# Altium schematic sheet DACs.SchDoc
size A4
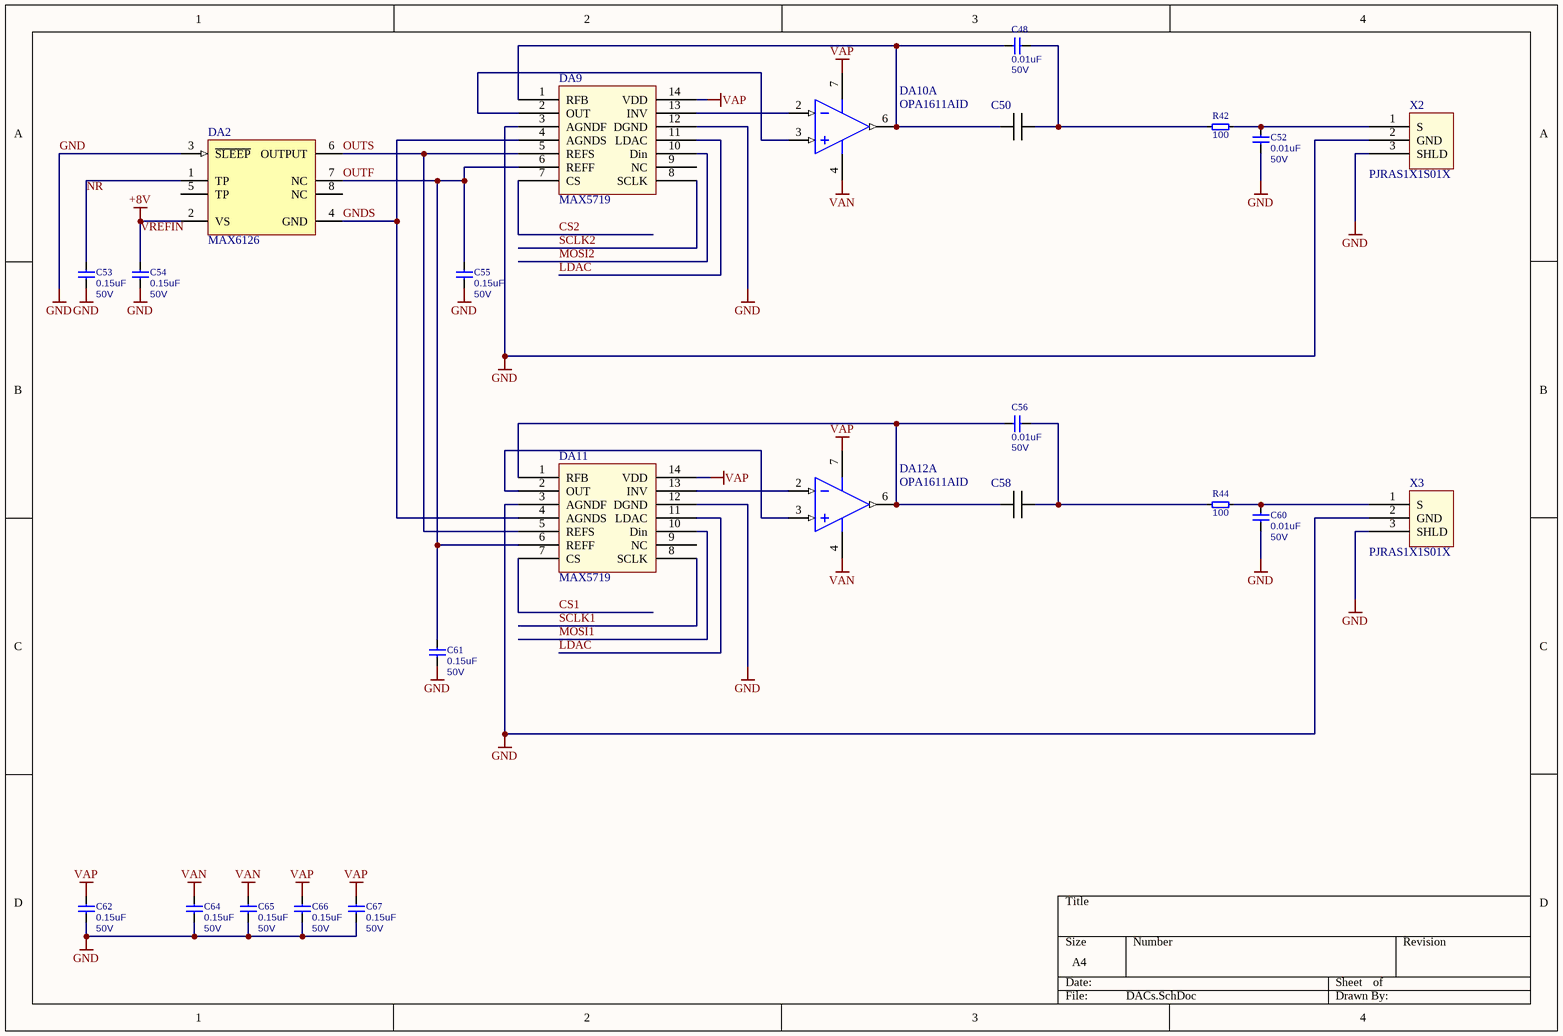
[diagram p0: DACs.SchDoc]

## Parts
C48  Capacitance: 0.01uF  Voltage: 50V  [C_1206]
C50  Cap_film  [Al_cap_d=5,_l_s=2.54]  (value not drawn)
C52  Capacitance: 0.01uF  Voltage: 50V  [C_1206]
C53  Capacitance: 0.15uF  Voltage: 50V  [C_1206]
C54  Capacitance: 0.15uF  Voltage: 50V  [C_1206]
C55  Capacitance: 0.15uF  Voltage: 50V  [C_1206]
C56  Capacitance: 0.01uF  Voltage: 50V  [C_1206]
C58  Cap_film  [Al_cap_d=5,_l_s=2.54]  (value not drawn)
C60  Capacitance: 0.01uF  Voltage: 50V  [C_1206]
C61  Capacitance: 0.15uF  Voltage: 50V  [C_1206]
C62  Capacitance: 0.15uF  Voltage: 50V  [C_1206]
C64  Capacitance: 0.15uF  Voltage: 50V  [C_1206]
C65  Capacitance: 0.15uF  Voltage: 50V  [C_1206]
C66  Capacitance: 0.15uF  Voltage: 50V  [C_1206]
C67  Capacitance: 0.15uF  Voltage: 50V  [C_1206]
DA2  MAX6126  [ADI-R-8_M]
DA9  MAX5719  [D14]
DA10  OPA1611AID  [TI-D8_M]  (part A of 2)
DA11  MAX5719  [D14]
DA12  OPA1611AID  [TI-D8_M]  (part A of 2)
R42  Resistance: 100  [R_1206]
R44  Resistance: 100  [R_1206]
X2  PJRAS1X1S01X  [RCA_connector]
X3  PJRAS1X1S01X  [RCA_connector]

## Nets
GND: C52.2 C53.2 C54.2 C55.2 C60.2 C61.2 C62.2 C64.2 C65.2 C66.2 C67.2 DA2.3(~{SLEEP}) DA9.3(AGNDF) DA9.12(DGND) DA11.3(AGNDF) DA11.12(DGND) X2.2(GND) X2.3(SHLD) X3.2(GND) X3.3(SHLD)
VAN: C64.1 C65.1 DA10.4(V-) DA12.4(V-)
VAP: C62.1 C66.1 C67.1 DA9.14(VDD) DA10.7(V+) DA11.14(VDD) DA12.7(V+)
VREFIN: C54.1 DA2.2(VS)  [also labelled +8V]
CS1: DA11.7(CS)
CS2: DA9.7(CS)
GNDS: DA2.4(GND) DA9.4(AGNDS) DA11.4(AGNDS)
LDAC: DA9.11(LDAC) DA11.11(LDAC)
MOSI1: DA11.10(Din)
MOSI2: DA9.10(Din)
NR: C53.1 DA2.1(TP)
OUTF: C55.1 C61.1 DA2.7(NC) DA9.6(REFF) DA11.6(REFF)
OUTS: DA2.6(OUTPUT) DA9.5(REFS) DA11.5(REFS)
SCLK1: DA11.8(SCLK)
SCLK2: DA9.8(SCLK)
NetC48_1: C48.1 C50.1 DA9.1(RFB) DA10.6(OUT)
NetC48_2: C48.2 C50.2 R42.1
NetC52_1: C52.1 R42.2 X2.1(S)
NetC56_1: C56.1 C58.1 DA11.1(RFB) DA12.6(OUT)
NetC56_2: C56.2 C58.2 R44.1
NetC60_1: C60.1 R44.2 X3.1(S)
NetDA9_2: DA9.2(OUT) DA10.3(IN+)
NetDA9_13: DA9.13(INV) DA10.2(IN-)
NetDA11_2: DA11.2(OUT) DA12.3(IN+)
NetDA11_13: DA11.13(INV) DA12.2(IN-)

Not connected (* = marked no-connect by the designer): DA2 5(TP) 8(NC); DA9 9(NC); DA11 9(NC)

## Library data of the parts
C48 C52 C56 C60 = C_SMD_ceramic: Capacitor; Manufacturer_part_number: ECH-U1H103GX5
C53-C55 C61 C62 C64-C67 = C_SMD_ceramic: Capacitor; Manufacturer_part_number: ECP-U1C154MA5
DA2 = REF192GS: Precision Micropower, Low Dropout Voltage Reference, 2.5 V Output, 2.6 to 15 V Supply, Industrial, 8-pin SOIC (R-8), Tube; Manufacturer_part_number: MAX6126BASA41+
DA9 DA11 = MAX5719: Manufacturer_part_number: MAX5719AGSD+
DA10 DA12 = OPA1611AID: 1.1 nV/rtHz Noise, Low Power, Precision Operational Amplifier, 4.5 to 36 V, -40 to 85 degC, 8-pin SOIC (D8), Green (RoHS & no Sb/Br); Manufacturer: Texas Instruments; Manufacturer_part_number: OPA1611AIDR; GBW(Typ)(MHz): 40; Iq per channel(Max)(mA): 4.5; Number of Channels: 1; SubFamily: Audio Operational Amplifier; Vmax(V): 36; Vn at Flatband(Typ)(nV/rtHz): 1.1; DatasheetVersion: SBOS450B; PackageVersion: 4040047-3/M, 06/2011; PackageReference: D8; PackageDescription: 8-Pin Plastic Small Outline, Body 4.9 x 3.9 mm, Pitch 1.27 mm; Supplier 1: Digi-Key; Supplier Part Number 1: 296-24958-5-ND; Supplier 2: Farnell; Supplier Part Number 2: 1754264; Supplier 3: Newark; Supplier Part Number 3: 50R7815; Supplier 4: Mouser; Supplier Part Number 4: 595-OPA1611AID; Eco-Plan: Green (RoHS & no Sb/Br); Vmin(V): 4.5; Mounting Technology: Surface Mount; Code_JEDEC: MS-012; PartNumber: OPA1611AID; ComponentLink1Description: Manufacturer URL; ComponentLink1URL: http://www.ti.com/; ComponentLink2Description: Datasheet; ComponentLink2URL: http://www.ti.com/general/docs/lit/getliterature.tsp?genericPartNumber=OPA1611&fileType=pdf; ComponentLink3Description: Package Specification; ComponentLink3URL: http://www.ti.com/litv/pdf/msoi002j
R42 R44 = R_SMD: Resistor; Manufacturer_part_number: ERJ-8ENF1000V
X2 X3 = RCA_connector: Manufacturer_part_number: PJRAS1X1S01X